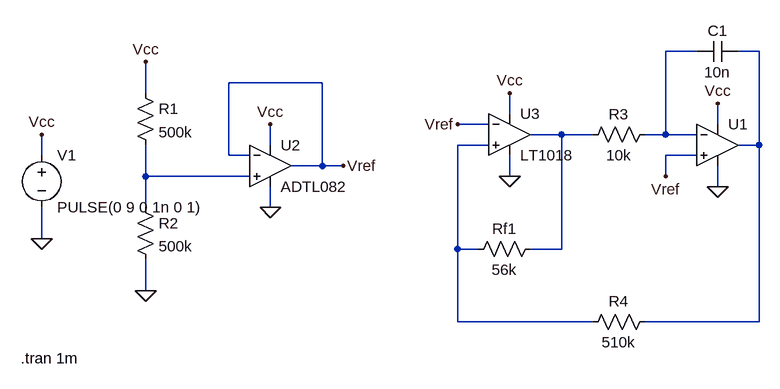
[diagram p0: schematic Draft1.asc]
Draft1.asc, the LTspice schematic file:
Version 4
SHEET 1 880 680
WIRE 48 16 0 16
WIRE 144 16 112 16
WIRE -528 64 -672 64
WIRE -800 80 -800 32
WIRE -240 112 -240 80
WIRE -272 128 -320 128
WIRE 80 128 80 96
WIRE -160 144 -208 144
WIRE -112 144 -160 144
WIRE 0 144 0 16
WIRE 0 144 -32 144
WIRE 48 144 0 144
WIRE -608 160 -608 128
WIRE -272 160 -320 160
WIRE 144 160 144 16
WIRE 144 160 112 160
WIRE -960 176 -960 144
WIRE -672 176 -672 64
WIRE -640 176 -672 176
WIRE 48 176 0 176
WIRE -528 192 -528 64
WIRE -528 192 -576 192
WIRE -496 192 -528 192
WIRE -800 208 -800 160
WIRE -640 208 -800 208
WIRE -240 208 -240 176
WIRE 0 208 0 176
WIRE 80 224 80 192
WIRE -800 256 -800 208
WIRE -608 256 -608 224
WIRE -960 304 -960 256
WIRE -320 320 -320 160
WIRE -288 320 -320 320
WIRE -160 320 -160 144
WIRE -160 320 -208 320
WIRE -800 384 -800 336
WIRE -320 432 -320 320
WIRE -112 432 -320 432
WIRE 144 432 144 160
WIRE 144 432 -32 432
FLAG -960 304 0
FLAG -960 144 Vcc
FLAG -240 208 0
FLAG 80 224 0
FLAG -608 128 Vcc
FLAG -608 256 0
FLAG -800 384 0
FLAG -800 32 Vcc
FLAG -496 192 Vref
FLAG -240 80 Vcc
FLAG 80 96 Vcc
FLAG -320 128 Vref
FLAG 0 208 Vref
SYMBOL OpAmps\\ADTL082 -608 128 R0
SYMATTR InstName U2
SYMBOL voltage -960 160 R0
WINDOW 123 0 0 Left 0
WINDOW 39 0 0 Left 0
SYMATTR InstName V1
SYMATTR Value PULSE(0 9 0 1n 0 1)
SYMBOL Comparators\\LT1018 -240 144 R0
SYMATTR InstName U3
SYMBOL res -816 64 R0
SYMATTR InstName R1
SYMATTR Value 500k
SYMBOL res -816 240 R0
SYMATTR InstName R2
SYMATTR Value 500k
SYMBOL res -192 304 R90
WINDOW 0 0 56 VBottom 2
WINDOW 3 32 56 VTop 2
SYMATTR InstName Rf1
SYMATTR Value 56k
SYMBOL res -16 128 R90
WINDOW 0 0 56 VBottom 2
WINDOW 3 32 56 VTop 2
SYMATTR InstName R3
SYMATTR Value 10k
SYMBOL cap 112 0 R90
WINDOW 0 0 32 VBottom 2
WINDOW 3 32 32 VTop 2
SYMATTR InstName C1
SYMATTR Value 10n
SYMBOL res -16 416 R90
WINDOW 0 0 56 VBottom 2
WINDOW 3 32 56 VTop 2
SYMATTR InstName R4
SYMATTR Value 510k
SYMBOL OpAmps\\UniversalOpAmp2 80 160 R0
SYMATTR InstName U1
TEXT -992 488 Left 2 !.tran 1m

The netlist it stands for:
* Draft1.asc
XU2 N005 Vref Vcc 0 Vref ADTL082  ; pins In+ In- V+ V- OUT
V1 Vcc 0 PULSE(0 9 0 1n 0 1)
XU3 N004 Vref Vcc 0 N003 LT1018  ; pins In+ In- V+ V- OUT
R1 Vcc N005 500k
R2 N005 0 500k
Rf1 N003 N004 56k
R3 N001 N003 10k
C1 N002 N001 10n
R4 N002 N004 510k
XU1 Vref N001 Vcc 0 N002 level2 Avol=1Meg GBW=10Meg Slew=10Meg Ilimit=25m Rail=0 Vos=0 En=0 Enk=0 In=0 Ink=0 Rin=500Meg  ; pins In+ In- V+ V- OUT
.tran 1m
.lib ADI.lib
.lib LTC1.lib
.lib UniversalOpAmp2.lib
.backanno
.end